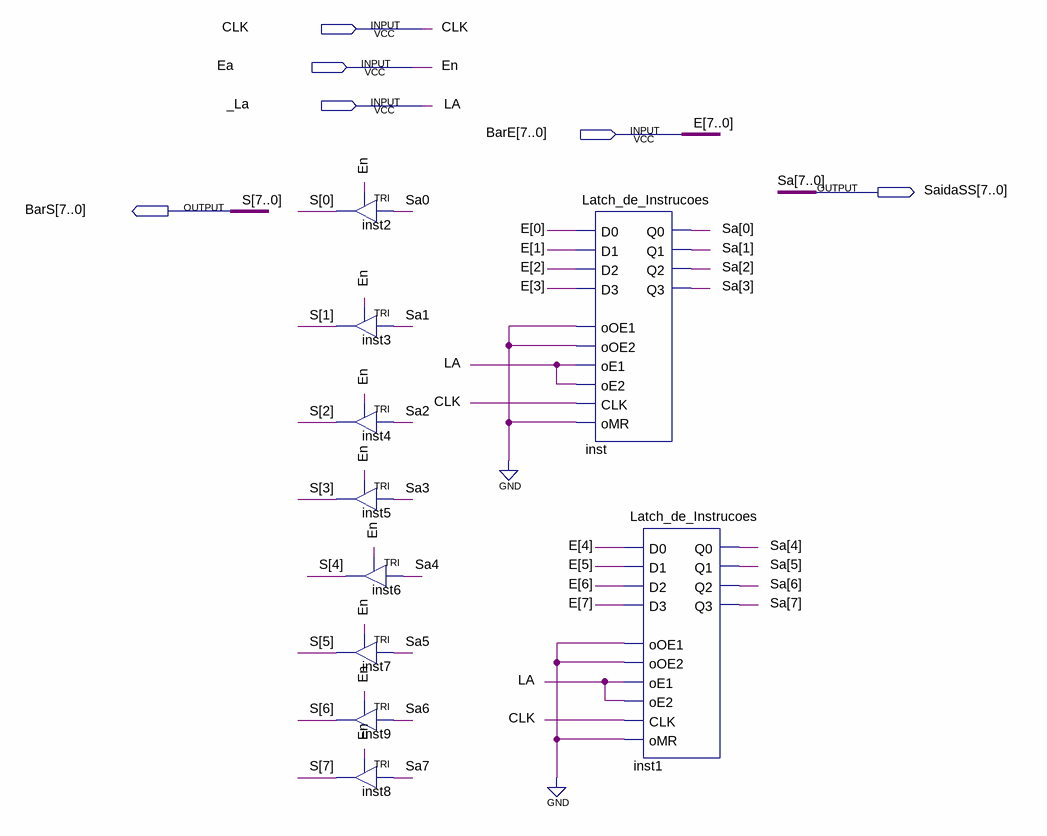
[diagram p0: schematic sheet]
// Quartus schematic Acumulador.bdf as structural Verilog: 10 symbols, 6 pins
module Acumulador (
  input  CLK,
  input  Ea,
  input  _La,
  input  [7:0] BarE,
  output [7:0] SaidaSS,
  output [7:0] BarS
);

  TRI inst2 (.IN(SaidaSS[0]), .OE(Ea), .OUT(BarS[0]));
  TRI inst3 (.IN(SaidaSS[1]), .OE(Ea), .OUT(BarS[1]));
  TRI inst4 (.IN(SaidaSS[2]), .OE(Ea), .OUT(BarS[2]));
  TRI inst5 (.IN(SaidaSS[3]), .OE(Ea), .OUT(BarS[3]));
  TRI inst6 (.IN(SaidaSS[4]), .OE(Ea), .OUT(BarS[4]));
  TRI inst7 (.IN(SaidaSS[5]), .OE(Ea), .OUT(BarS[5]));
  TRI inst9 (.IN(SaidaSS[6]), .OE(Ea), .OUT(BarS[6]));
  TRI inst8 (.IN(SaidaSS[7]), .OE(Ea), .OUT(BarS[7]));
  Latch_de_Instrucoes inst (
    .D0(BarE[0]), .D1(BarE[1]), .D2(BarE[2]), .D3(BarE[3]), .oOE1(1'b0), .oOE2(1'b0), .oE1(_La), .oE2(_La),
    .CLK(CLK), .oMR(1'b0), .Q0(SaidaSS[0]), .Q1(SaidaSS[1]), .Q2(SaidaSS[2]), .Q3(SaidaSS[3]));
  Latch_de_Instrucoes inst1 (
    .D0(BarE[4]), .D1(BarE[5]), .D2(BarE[6]), .D3(BarE[7]), .oOE1(1'b0), .oOE2(1'b0), .oE1(_La), .oE2(_La),
    .CLK(CLK), .oMR(1'b0), .Q0(SaidaSS[4]), .Q1(SaidaSS[5]), .Q2(SaidaSS[6]), .Q3(SaidaSS[7]));

  // Other names for the same wires on the sheet: E[7:0] = BarE; En = Ea; LA = _La; S[7:0] = BarS; Sa[7:0] = SaidaSS;
  //   Sa0 = SaidaSS[0]; Sa1 = SaidaSS[1]; Sa2 = SaidaSS[2]; Sa3 = SaidaSS[3]; Sa4 = SaidaSS[4]; Sa5 = SaidaSS[5];
  //   Sa6 = SaidaSS[6]; Sa7 = SaidaSS[7]
endmodule
